# EAGLE design main_board (EAGLE 8.0.1)
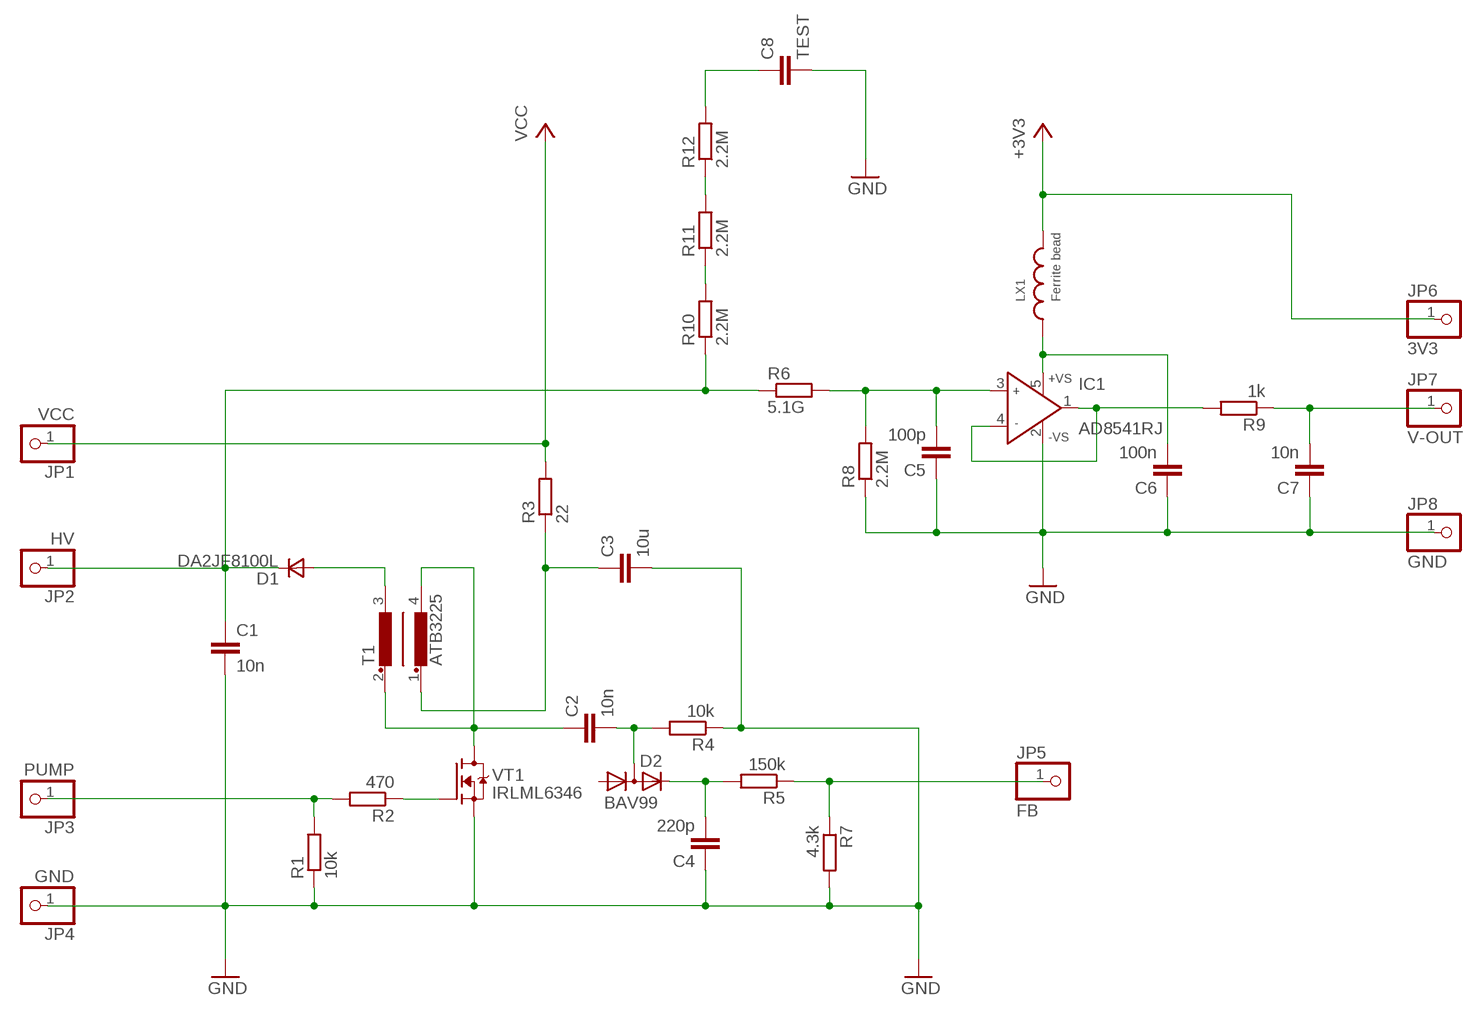
[diagram p0: schematic, sheet 1]

## Parts
C1  10n  C-EUC1206  [C1206]
C2  10n  C-EUC0805  [C0805]
C3  10u  C-EUC0805  [C0805]
C4  220p  C-EUC0805  [C0805]
C5  100p  C-EUC0805  [C0805]
C6  100n  C-EUC0805  [C0805]
C7  10n  C-EUC0805  [C0805]
C8  TEST  C-EUC1206  [C1206]
D1  DA2JF8100L  DSOD323  [SOD323]
D2  BAV99  [SOT23]
IC1  AD8541RJ  [SOT23-5]
JP1  VCC  PINHD-1X1  [1X01]
JP2  HV  PINHD-1X1  [1X01]
JP3  PUMP  PINHD-1X1  [1X01]
JP4  GND  PINHD-1X1  [1X01]
JP5  FB  PINHD-1X1  [1X01]
JP6  3V3  PINHD-1X1  [1X01]
JP7  V-OUT  PINHD-1X1  [1X01]
JP8  GND  PINHD-1X1  [1X01]
LX1  Ferrite bead  WE-KI_0805A_744760022A  [WE-KI_0805A]
R1  10k  R-EU_M0805  [M0805]
R2  470  R-EU_M0805  [M0805]
R3  22  R-EU_M0805  [M0805]
R4  10k  R-EU_M0805  [M0805]
R5  150k  R-EU_M0805  [M0805]
R6  5.1G  R-EU_0817/22  [P0817/22]
R7  4.3k  R-EU_M0805  [M0805]
R8  2.2M  R-EU_M0805  [M0805]
R9  1k  R-EU_M0805  [M0805]
R10  2.2M  R-EU_M0805  [M0805]
R11  2.2M  R-EU_M0805  [M0805]
R12  2.2M  R-EU_M0805  [M0805]
T1  ATB3225  [ATB3225]
VT1  IRLML6346  MOSFET-N-SOT23  [SOT23]

## Nets
+3V3 [power]: JP6.1 LX1.2
FB: JP5.1 R5.1 R7.1
GND [power]: C1.2 C3.2 C4.1 C5.1 C6.1 C7.1 C8.2 IC1.2(-VS) JP4.1 JP8.1 R1.1 R4.1 R7.2 R8.1 VT1.2(S)
HV [HV]: C1.1 D1.1(C) JP2.1 R6.1 R10.1
N$1 [HV]: D1.2(A) T1.3
N$2: C6.2 IC1.5(+VS) LX1.1
N$3: C2.1 T1.2 T1.4 VT1.3(D)
N$4 [power]: C3.1 R3.1 T1.1
N$5: C2.2 D2.3(K1A2) R4.2
N$6 [HV]: R10.2 R11.1
N$7: R2.1 VT1.1(G)
N$8 [HV]: R11.2 R12.1
N$9: C4.2 D2.2(K2) R5.2
N$10: IC1.1(OUT) IC1.4(IN-) R9.2
N$14 [HV]: C5.2 IC1.3(IN+) R6.2 R8.2
PUMP: JP3.1 R1.2 R2.2
TEST [HV]: C8.1 R12.2
V-OUT: C7.2 JP7.1 R9.1
VCC [power]: JP1.1 R3.2
Unconnected: D2.1(A1)

## Library data of the parts
C1-C8 = rcl:C-EU: CAPACITOR, European symbol
D1 = zetex:D: DIODE; MPN: CDSOD323-T05C; OC_FARNELL: 1824860; OC_NEWARK: 79R6078
D2 = NXP_60_26022015:BAV99: High-speed switching diode High-speed switching diodes, encapsulated in small Surface-Mounted Device (SMD) plastic packages. AAL Eindhoven MK
IC1 = analog-devices:AD8541: General-Purpose CMOS Rail-to-Rail Amplifiers Source: http://www.analog.com/static/imported-files/data_sheets/AD8541_8542_8544.pdf; MF: ALTERA CORPORATION; MPN: AD8541ARTZ-REEL7; OC_FARNELL: 1464963; OC_NEWARK: 88H0268
JP1-JP8 = pinhead:PINHD-1X1: PIN HEADER
LX1 = SignalCommunications (rev18e):WE-KI_0805A: SMD Wire Wound Ceramic Inductor Characteristics WE-KI series offers you an excellent Q factor and highest possible self resonant frequencies up to 12.5 GHz Inductance tolerances: 5% (2% on request) High thermal stability Operating temperature: –40°C to +125°C Applications Especially developed for high frequency applications RF transceiver/communications Bluetooth Wireless LAN <http://katalog.we-online.de/media/images/v2/Family_we-ki%20hc_keramik_smd_induktivitaet.jpg> Details see: http://katalog.we-online.de/en/pbs/WE-KI Updated by Dan Xu 2014-07-08 2014 (C) Wurth Elektronik; WE-NUMBER: 744760022A/2,2nH
R1-R12 = resistor:R-EU_: RESISTOR, European symbol
T1 = atb322515:ATB3225: TRANSFORMER
VT1 = we-transistor:MOSFET-N: N-Channel MOSFET SOT23 N-Chn MOSFET TSM3404, TSM240N03 (Vgs>=+/-20V, Vds<=30V, Id>=3A + Rds<=0.05Ohm @ Vgs=4.5V) BSS138 (Vgs>=+/-20V, Vds<=40V, Id>=0.2A + Rds<=3Ohm @ Vgs=4.5V) SOT223 Low Side Switch with Protection (Infineon) BSP76 (Vin=0...10V, Vds<=42V, Id=1.4A + Rds=0.2Ohm @ Vin=5V) BSP77 (Vin=0...10V, Vds<=42V, Id=2.2A + Rds=0.1Ohm @ Vin=5V) D²Pak Low Side Switch with Protection (Infineon) BTS117TC (Vin=0...10V, Vds<=60V, Id=3.5A + Rds=0.12Ohm @ Vin=5V) BTS133TC (Vin=0...10V, Vds<=60V, Id=7A + Rds=0.06Ohm @ Vin=5V) BTS141TC (Vin=0...10V, Vds<=60V, Id=12A + Rds=0.03Ohm @ Vin=5V) BTS3018TC (Vin=0...10V, Vds<=60V, Id=6A + Rds=0.02Ohm @ Vin=5V)

## Net classes
0 default: width 0.4 mm
1 power: width 0.6 mm
2 HV: width 0.5 mm, clearance 0.8 mm

## Board
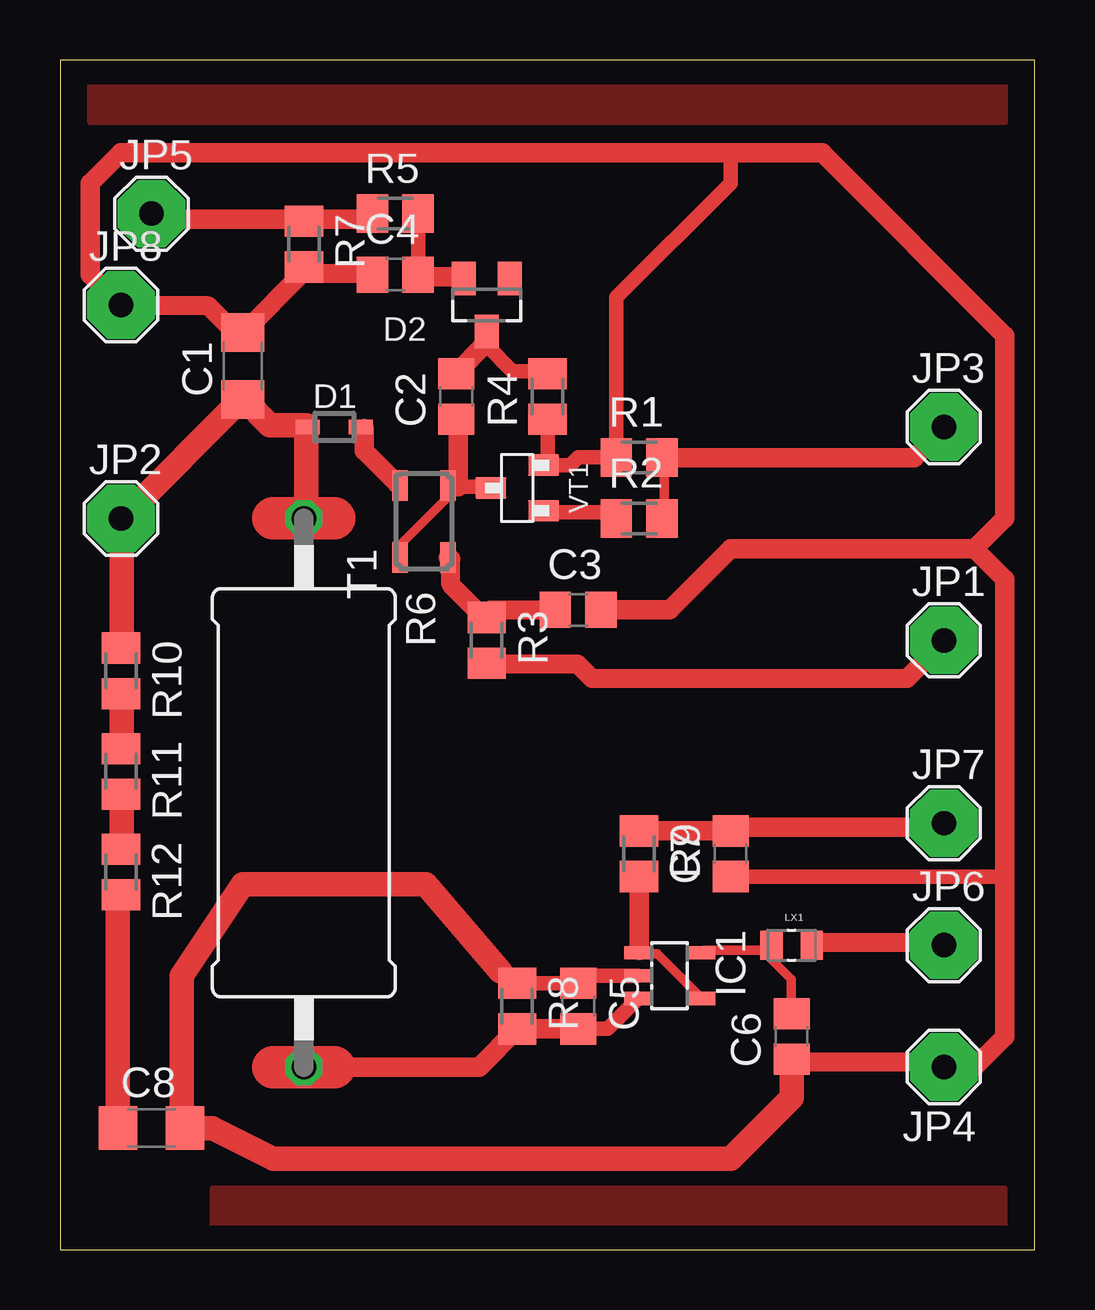
[diagram p1: board, top side]
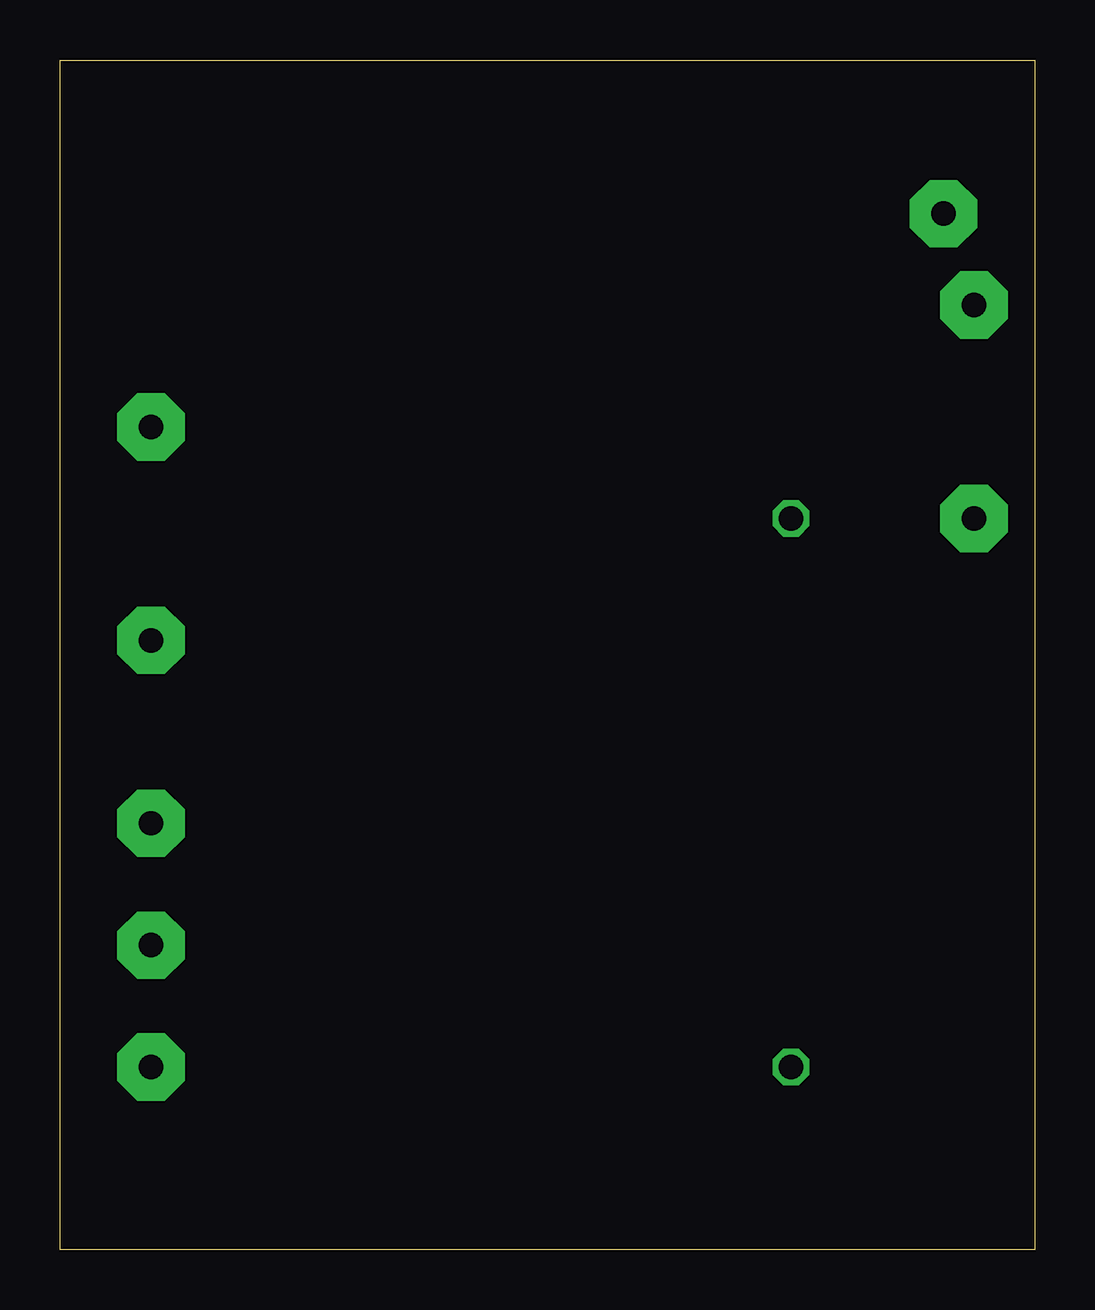
[diagram p2: board, bottom side, seen from below]

Size 40.62 x 49.58 mm. Coordinates in mm from the lower left corner, seen from the top.
Outline: 0,0 40.62,0 40.62,49.58 0,49.58 0,0
Copper layers (1*16): Top 0.035mm / dielectric 1.5mm / Bottom 0.035mm
Design rules "default": minimum track width 10mil, minimum drill 24mil, track to track 8mil, track to pad 8mil, pad to pad 8mil, via to via 8mil, smd to smd 8mil, copper to edge 40mil, drill to drill 8mil, minimum pad ring 10mil, minimum via ring 8mil, stop-mask expansion 4mil, vias tented up to drill 0mil, thermal gap 10mil

### Footprints (pad centres in the part's own frame; a part is rotated, then mirrored left to right if it is on the bottom)
C1206 = smd 1.6 x 1.8: 1 -1.4,0; 2 1.4,0
C0805 = smd 1.3 x 1.5: 1 -0.95,0; 2 0.95,0
SOD323 = smd 1 x 0.6: 1 -1.1,0; 2 1.1,0
SOT23 = smd 1 x 1.4: 1 -0.95,-1.1; 2 0.95,-1.1; 3 0,1.1
SOT23-5 = smd 0.55 x 1.2: 1 -0.95,-1.3; 2 0,-1.3; 3 0.95,-1.3; 4 0.95,1.3; 5 -0.95,1.3
1X01 = drill 1.016 pad 2.8 octagon: 1 0,0
WE-KI_0805A = smd 0.925 x 1.2: 1 -0.838,0; 2 0.838,0
M0805 = smd 1.3 x 1.6: 1 -0.95,0; 2 0.95,0
P0817/22 = drill 1.016 octagon: 1 -11.43,0; 2 11.43,0
ATB3225 = smd 1.27 x 0.635: 1 -1.619,-0.929; 2 -1.619,1.071; 3 1.381,1.071; 4 1.381,-0.929
SOT23' = smd 1.3 x 0.9: 1 -1.1,0.95; 2 -1.1,-0.95; 3 1.1,0

### Placement (x,y rotation side)
C1  7.62,36.83 90 top
C2  16.51,35.56 90 top
C3  21.59,26.67 0 top
C4  13.97,40.64 0 top
C5  21.59,10.16 270 top
C6  30.48,8.89 90 top
C7  27.94,16.51 90 top
C8  3.81,5.08 0 top
D1  11.43,34.29 0 top
D2  17.78,39.37 180 top
IC1  25.4,11.43 270 top
JP1  36.83,25.4 0 top
JP2  2.54,30.48 0 top
JP3  36.83,34.29 0 top
JP4  36.83,7.62 180 top
JP5  3.81,43.18 0 top
JP6  36.83,12.7 0 top
JP7  36.83,17.78 0 top
JP8  2.54,39.37 0 top
LX1  30.48,12.7 0 top
R1  24.13,33.02 0 top
R2  24.13,30.48 0 top
R3  17.78,25.4 270 top
R4  20.32,35.56 90 top
R5  13.97,43.18 0 top
R6  10.16,19.05 270 top
R7  10.16,41.91 270 top
R8  19.05,10.16 270 top
R9  24.13,16.51 270 top
R10  2.54,24.13 270 top
R11  2.54,19.94 270 top
R12  2.54,15.75 270 top
T1  15.24,30.48 90 top
VT1  IRLML6346  [SOT23']  19.05,31.75 180 top

### Tracks (layer width: path | path; a pad name or v marks a point on that pad's centre or on a via)
+3V3
  Top 0.8: LX1.2 31.37,12.79 36.8,12.79 JP6.1
FB
  Top 0.4: 12.82,42.95 12.97,43.1 R5.1 | 10.25,42.95 R7.1 10.1,42.95 | 3.92,42.95 3.83,43.04 JP5.1
  Top 0.813: 12.82,42.95 10.25,42.95 | 3.92,42.95 10.1,42.95
GND
  Top 0.61: IC1.2 21.91,11.43 C5.1 R8.1 18.35,11.62 | 5.08,5.21 C8.2 | C7.1 39.05,15.56 39.37,15.24 | R4.1 20.32,32.87 VT1.2 21.27,32.7 21.59,33.02 R1.1 23.18,39.69 27.94,44.45 27.94,45.72
  Top 0.8: 5.28,5.56 5.28,5.1 C8.2 | C4.1 12.97,40.69 10.4,40.69 10.25,40.84 R7.2 10.1,40.69 7.69,38.28 C1.2 7.24,38.28 6.18,39.34 2.56,39.34 JP8.1 | JP4.1 36.8,7.67 36.64,7.82 30.61,7.82 C6.1 30.16,8.12 | 28.05,15.51 C7.1 | 22.62,26.67 C3.2
  Top 0.813: JP4.1 38.1,7.62 39.37,8.89 39.37,15.24 39.37,27.94 38.1,29.21 | 22.62,26.67 25.4,26.67 27.94,29.21 38.1,29.21 | JP8.1 1.27,40.64 1.27,44.45 2.54,45.72 27.94,45.72 31.75,45.72 39.37,38.1 39.37,30.48 38.1,29.21
  Top 1.016: 18.35,11.62 15.24,15.24 7.62,15.24 5.08,11.43 5.08,5.21 5.08,5.08 6.35,5.08 8.89,3.81 27.94,3.81 30.48,6.35 C6.1
  Bottom 0.8: 36.8,7.67 JP4.1 | 2.56,39.34 JP8.1
HV
  Top 0.5: 2.56,25.16 R10.1 | 2.56,30.44 JP2.1 2.71,30.59 | 10.25,34.36 D1.1 10.25,34.06 | 7.69,35.41 C1.1 7.54,35.41 | 10.25,30.59 R6.1
  Top 1.016: 2.56,30.44 2.56,25.16 | 10.25,34.36 8.75,34.36 7.69,35.41 | 10.25,30.59 10.25,34.06 | 7.54,35.41 2.71,30.59
N$1
  Top 0.5: 12.67,34.21 D1.2 | 14.02,31.95 T1.3
  Top 0.813: 12.67,34.21 12.67,33.3 14.02,31.95
N$2
  Top 0.4: IC1.5 26.84,12.49 29.41,12.49 29.56,12.64 LX1.1 29.41,12.34 30.46,11.29 30.46,9.93 C6.2
N$3
  Top 0.4: T1.2 14.18,28.93 14.18,29.38 16.14,31.34 16.14,31.8 T1.4 16.29,31.8 16.59,31.8 | 17.95,31.8 VT1.3 | 16.59,34.51 C2.1
  Top 0.61: 16.59,31.8 17.95,31.8
  Top 0.813: 16.59,31.8 16.59,34.51
N$4
  Top 0.8: T1.1 16.29,28.78 16.29,27.72 17.64,26.37 R3.1 17.95,26.67 20.51,26.67 C3.1
N$5
  Top 0.4: 17.64,37.68 17.64,38.13 D2.3 17.79,37.68 | 16.59,36.62 C2.2 | 20.21,36.62 R4.2
  Top 0.61: 20.21,36.62 18.85,36.62 17.79,37.68
  Top 0.813: 16.59,36.62 17.64,37.68
N$6
  Top 0.5: 2.56,20.94 R11.1 | 2.56,23.05 R10.2
  Top 1.016: 2.56,23.05 2.56,20.94
N$7
  Top 0.4: 22.92,30.74 23.07,30.59 R2.1 | 20.21,30.74 VT1.1
  Top 0.61: 22.92,30.74 20.21,30.74
N$8
  Top 0.5: 2.56,16.71 R12.1 | 2.56,18.98 R11.2
  Top 1.016: 2.56,18.98 2.56,16.71
N$9
  Top 0.4: 16.74,40.54 D2.2 | 14.93,40.54 C4.2 14.93,40.69 | 14.93,43.1 R5.2
  Top 0.61: 14.93,40.69 14.93,43.1
  Top 0.813: 14.93,40.54 16.74,40.54
N$10
  Top 0.4: IC1.4 26.69,10.53 24.88,12.34 24.13,12.34 IC1.1 24.13,12.49 | 24.13,15.51 R9.2
  Top 0.813: 24.13,12.49 24.13,15.51
N$11
  pour Top (no thermals): 1.27,46.99 1.27,49.53 39.37,49.53 39.37,46.99
N$12
  pour Top (no thermals): 6.35,2.54 6.35,0 39.37,0 39.37,2.54
N$13
  Top 1.778: 11.43,30.48 8.89,30.48
N$14
  Top 0.5: 10.25,7.67 R6.2
  Top 0.61: C5.2 22.83,9.21 IC1.3
  Top 0.813: R6.2 11.43,7.62 17.46,7.62 R8.2 C5.2
  Top 1.778: 8.89,7.62 11.43,7.62
PUMP
  Top 0.4: R2.2 25.18,30.59 25.18,33 R1.2 25.33,33 | 36.8,34.21 JP3.1
  Top 0.813: 25.33,33 35.59,33 36.8,34.21
TEST
  Top 0.5: 2.41,14.76 R12.2 | 2.41,5.1 C8.1
  Top 1.016: 2.41,5.1 2.41,14.76
V-OUT
  Top 0.4: 27.9,17.47 C7.2 28.05,17.62 | 24.28,17.47 R9.1 | 36.64,17.62 36.8,17.77 JP7.1
  Top 0.813: 24.28,17.47 27.9,17.47 | 36.64,17.62 28.05,17.62
VCC
  Top 0.8: R3.2 17.79,24.41 21.56,24.41 22.17,23.8 35.29,23.8 36.8,25.31 JP1.1